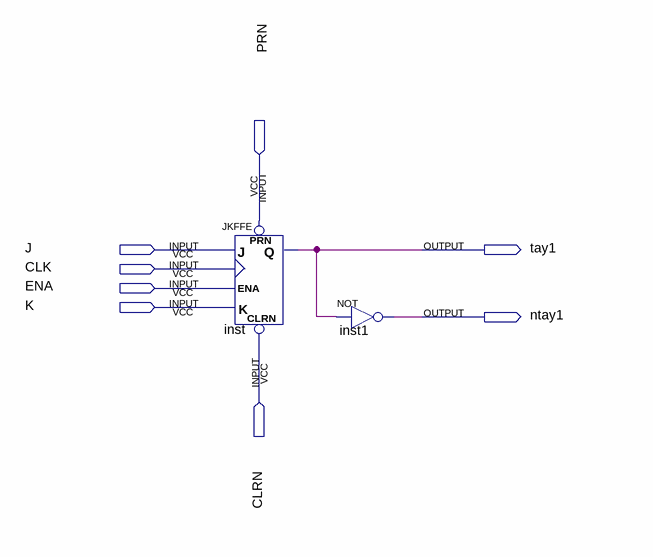
[diagram p0: schematic sheet]
// Quartus schematic jktrig.bdf as structural Verilog: 2 symbols, 8 pins
module jktrig (
  input  PRN,
  input  J,
  input  CLK,
  input  ENA,
  input  K,
  input  CLRN,
  output tay1,
  output ntay1
);

  JKFFE inst (.PRN(PRN), .J(J), .CLK(CLK), .CLRN(CLRN), .K(K), .ENA(ENA), .Q(tay1));
  not inst1 (ntay1, tay1);
endmodule
